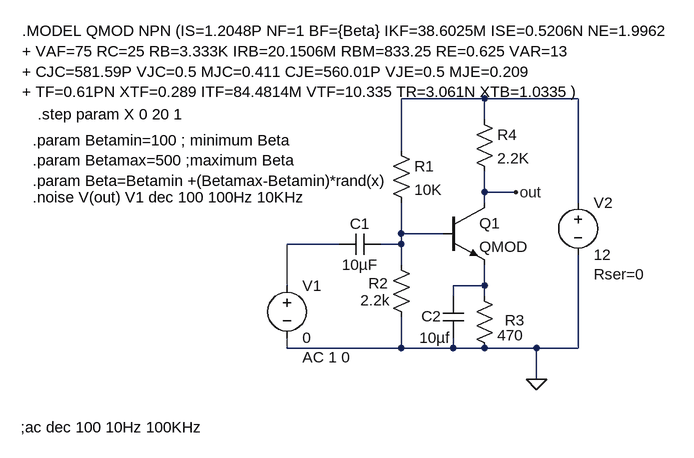
[diagram p0: schematic Brian.asc]
Brian.asc, the LTspice schematic file:
Version 4
SHEET 1 952 680
WIRE 0 160 0 208
WIRE 0 208 64 208
WIRE 0 208 0 224
WIRE 128 256 128 288
WIRE 0 80 0 0
WIRE 0 0 128 0
WIRE 128 0 128 32
WIRE 128 144 128 160
WIRE 0 336 0 384
WIRE 0 384 80 384
WIRE 208 384 208 432
WIRE -32 224 0 224
WIRE 0 224 0 256
WIRE 80 368 80 384
WIRE 80 384 128 384
WIRE 80 304 80 288
WIRE 80 288 128 288
WIRE 128 288 128 304
WIRE 272 160 272 0
WIRE 272 0 128 0
WIRE 272 240 272 384
WIRE 272 384 208 384
WIRE 208 384 128 384
WIRE -176 288 -176 224
WIRE -176 224 -96 224
WIRE -176 384 0 384
WIRE -176 384 -176 368
WIRE 176 144 128 144
WIRE 128 112 128 144
FLAG 208 432 0
FLAG 176 144 out
SYMBOL C:\Program\ Files\LTC\SwCADIII\lib\sym\res -16 64 R0
SYMATTR InstName R1
SYMATTR Value 10K
SYMBOL C:\Program\ Files\LTC\SwCADIII\lib\sym\res -16 240 R0
WINDOW 0 -35 44 Left 0
WINDOW 3 -47 70 Left 0
SYMATTR InstName R2
SYMATTR Value 2.2k
SYMBOL C:\Program\ Files\LTC\SwCADIII\lib\sym\npn 64 160 R0
SYMATTR InstName Q1
SYMATTR Value QMOD
SYMBOL C:\Program\ Files\LTC\SwCADIII\lib\sym\res 112 288 R0
WINDOW 0 47 53 Left 0
SYMATTR InstName R3
SYMATTR Value 470
SYMBOL C:\Program\ Files\LTC\SwCADIII\lib\sym\res 112 16 R0
SYMATTR InstName R4
SYMATTR Value 2.2K
SYMBOL C:\Program\ Files\LTC\SwCADIII\lib\sym\cap -32 208 R90
WINDOW 0 0 32 VBottom 0
WINDOW 3 32 32 VTop 0
SYMATTR InstName C1
SYMATTR Value 10µF
SYMBOL C:\Program\ Files\LTC\SwCADIII\lib\sym\cap 64 304 R0
WINDOW 0 -33 31 Left 0
WINDOW 3 -36 64 Left 0
SYMATTR InstName C2
SYMATTR Value 10µf
SYMBOL C:\Program\ Files\LTC\SwCADIII\lib\sym\voltage -176 272 R0
WINDOW 123 24 126 Left 0
WINDOW 39 0 0 Left 0
SYMATTR Value2 AC 1 0
SYMATTR InstName V1
SYMATTR Value 0
SYMBOL C:\Program\ Files\LTC\SwCADIII\lib\sym\voltage 272 144 R0
WINDOW 123 0 0 Left 0
WINDOW 39 24 126 Left 0
SYMATTR SpiceLine Rser=0
SYMATTR InstName V2
SYMATTR Value 12
TEXT -584 -104 Left 0 !.MODEL QMOD NPN (IS=1.2048P NF=1 BF={Beta} IKF=38.6025M ISE=0.5206N NE=1.9962\n+ VAF=75 RC=25 RB=3.333K IRB=20.1506M RBM=833.25 RE=0.625 VAR=13\n+ CJC=581.59P VJC=0.5 MJC=0.411 CJE=560.01P VJE=0.5 MJE=0.209\n+ TF=0.61PN XTF=0.289 ITF=84.4814M VTF=10.335 TR=3.061N XTB=1.0335 )
TEXT -560 24 Left 0 !.step param X 0 20 1
TEXT -568 64 Left 0 !.param Betamin=100 ; minimum Beta\n.param Betamax=500 ;maximum Beta\n.param Beta=Betamin +(Betamax-Betamin)*rand(x)
TEXT -586 506 Left 0 !;ac dec 100 10Hz 100KHz
TEXT -568 152 Left 0 !.noise V(out) V1 dec 100 100Hz 10KHz

The netlist it stands for:
* Brian.asc
R1 N003 N001 10K
R2 N001 0 2.2k
Q1 out N001 N002 0 QMOD
R3 N002 0 470
R4 N003 out 2.2K
C1 N001 N004 10µF
C2 N002 0 10µf
V1 N004 0 0 AC 1 0
V2 N003 0 12 Rser=0
.model NPN NPN
.model PNP PNP
.lib standard.bjt
.MODEL QMOD NPN (IS=1.2048P NF=1 BF={Beta} IKF=38.6025M ISE=0.5206N NE=1.9962
+ VAF=75 RC=25 RB=3.333K IRB=20.1506M RBM=833.25 RE=0.625 VAR=13
+ CJC=581.59P VJC=0.5 MJC=0.411 CJE=560.01P VJE=0.5 MJE=0.209
+ TF=0.61PN XTF=0.289 ITF=84.4814M VTF=10.335 TR=3.061N XTB=1.0335 )
.step param X 0 20 1
.param Betamin=100 ; minimum Beta
.param Betamax=500 ;maximum Beta
.param Beta=Betamin +(Betamax-Betamin)*rand(x)
;ac dec 100 10Hz 100KHz
.noise V(out) V1 dec 100 100Hz 10KHz
.backanno
.end